# EAGLE design PICTrack (EAGLE 7.2.0)
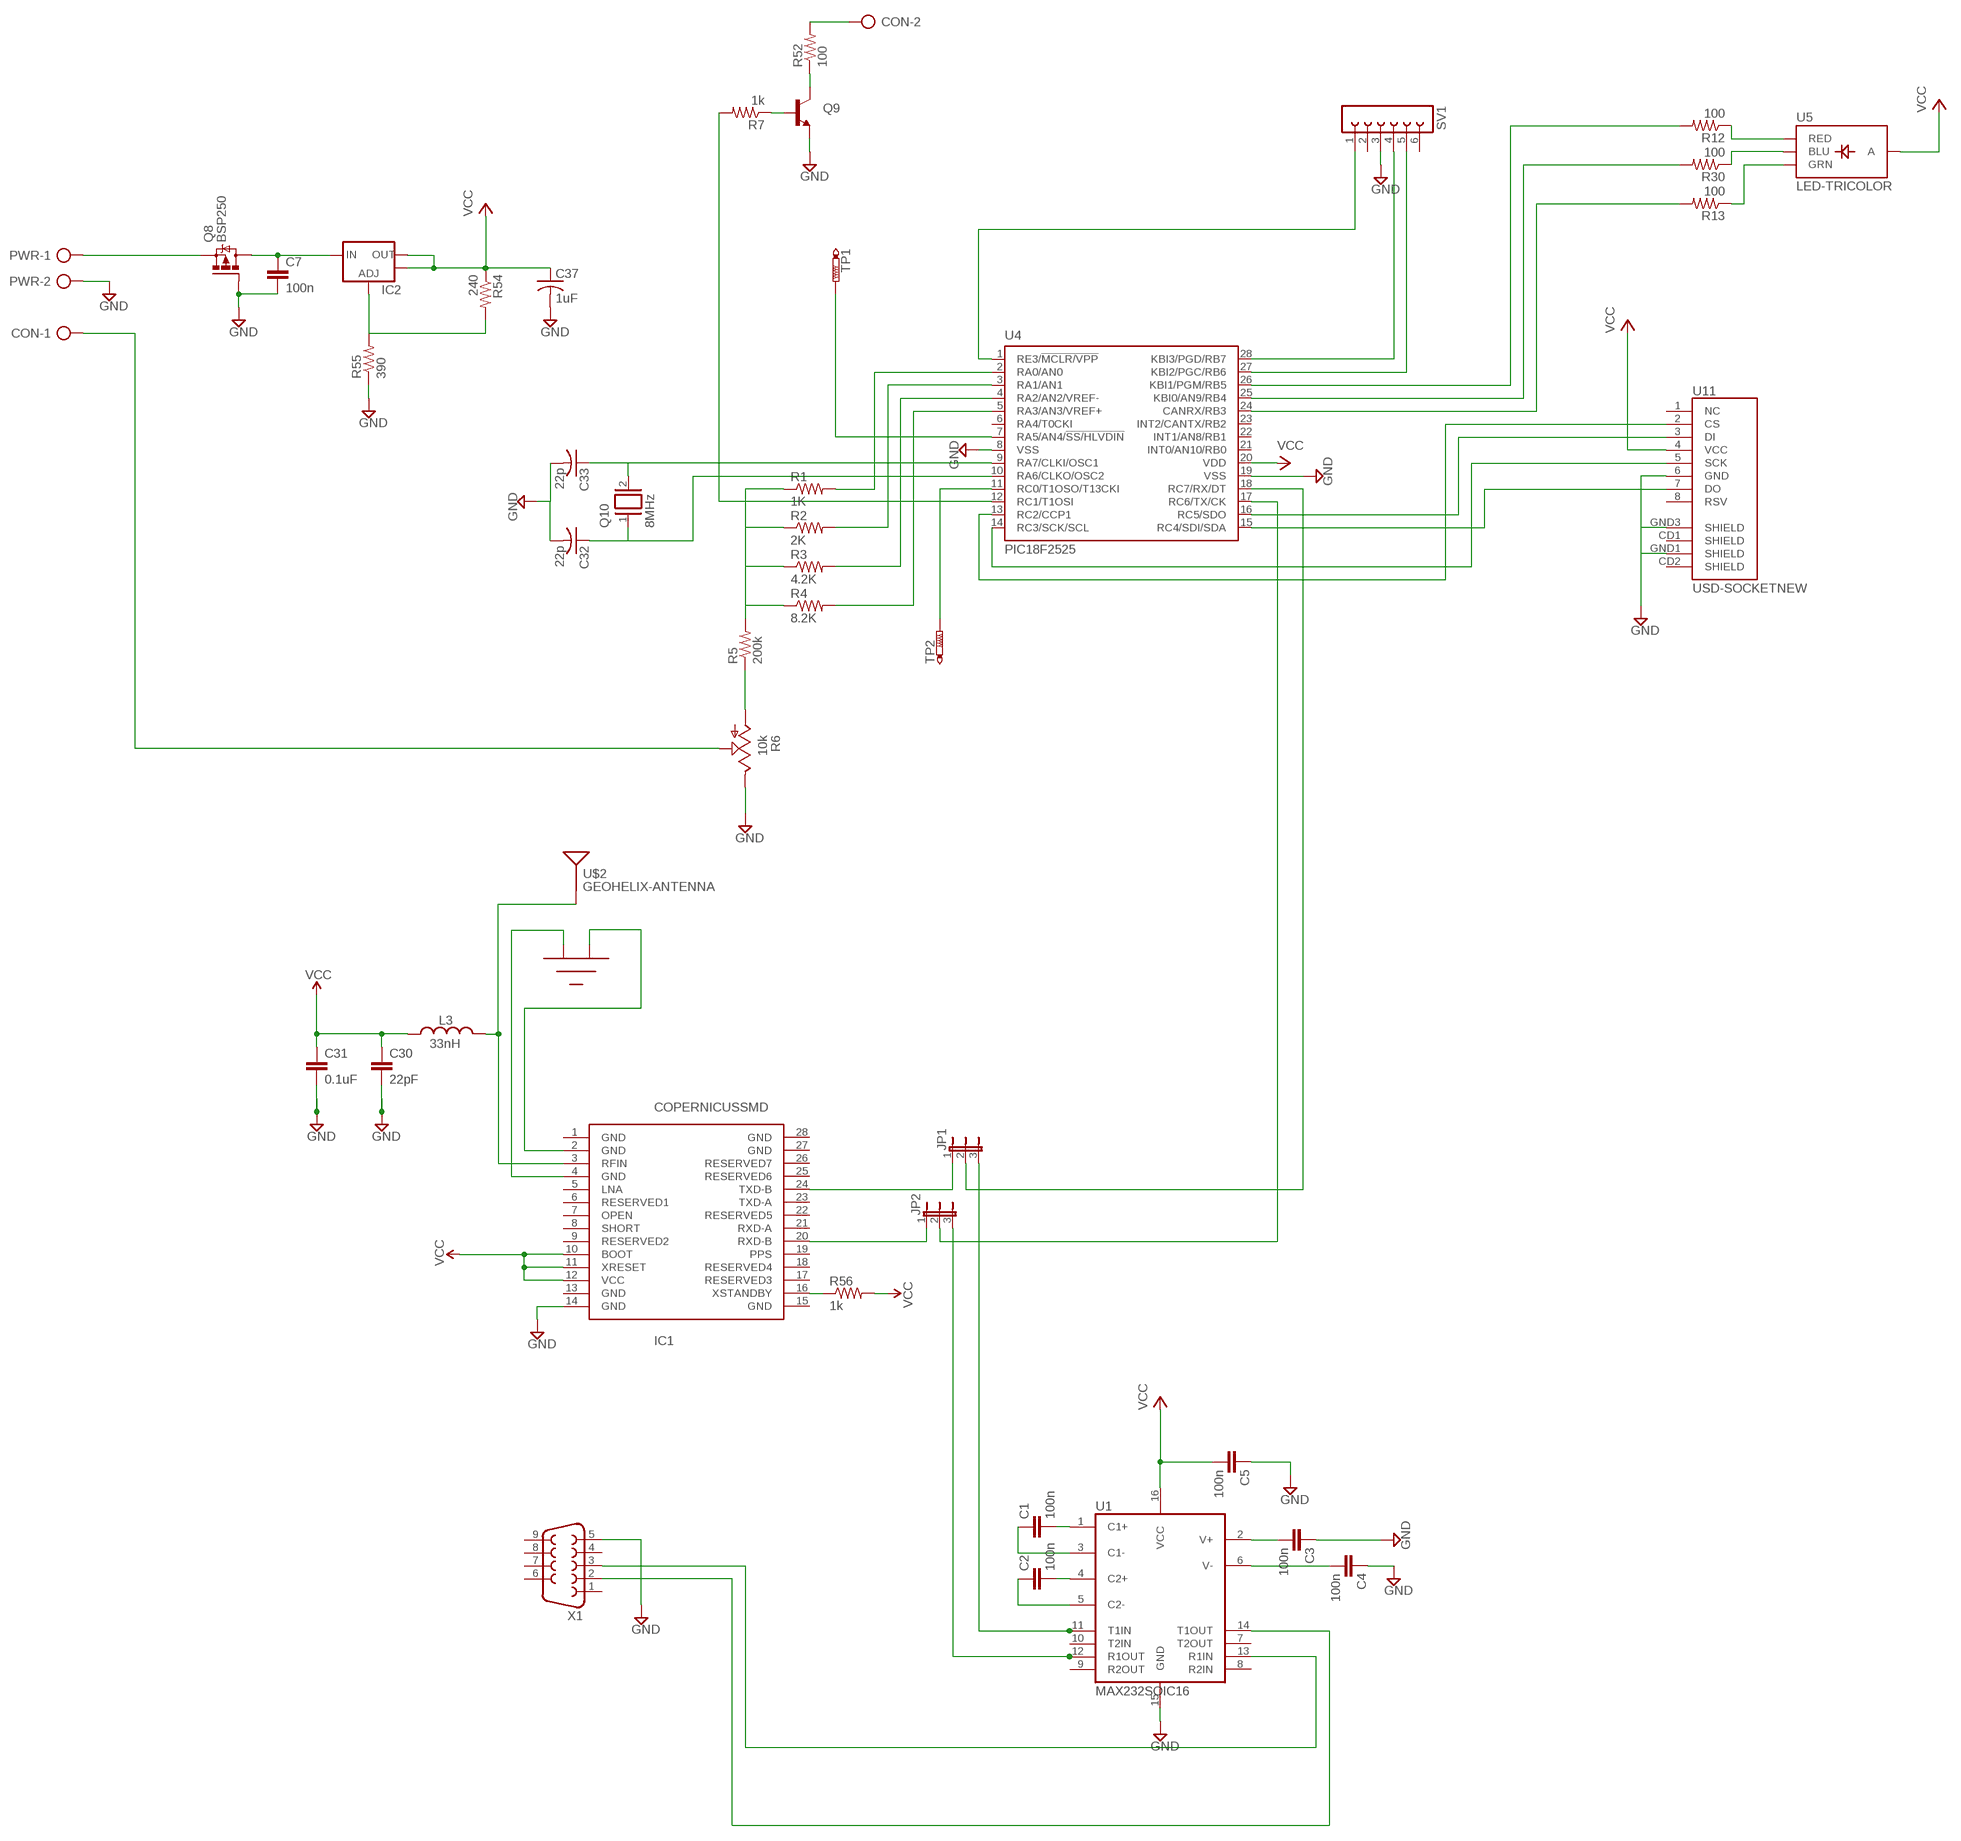
[diagram p0: schematic, sheet 1]

## Parts
C1  100n  C-EUC0402  [C0402]
C2  100n  C-EUC0402  [C0402]
C3  100n  C-EUC0402  [C0402]
C4  100n  C-EUC0402  [C0402]
C5  100n  C-EUC0402  [C0402]
C7  100n  C-EUC0402  [C0402]
C30  22pF  CAP0402-CAP  [0402-CAP]
C31  0.1uF  CAP0402-CAP  [0402-CAP]
C32  22p  C-USC0603  [C0603]
C33  22p  C-USC0603  [C0603]
C37  1uF  C-US025-030X050  [C025-030X050]
CON  AK300/2  [AK300/2]
IC1  COPERNICUSSMD  [COPERNICUS]
IC2  V_REG_LM1117SOT223  [SOT223]
JP1  JP2E  [JP2]
JP2  JP2E  [JP2]
L3  33nH  INDUCTOR0402  [C0402]
PWR  AK300/2  [AK300/2]
Q8  BSP250  [SOT223]
Q9  TRANSISTOR_NPNSOT23  [SOT23]
Q10  8MHz  XTAL/S  [QS]
R1  1K  R-US_0411/3V  [0411V]
R2  2K  R-US_0411/3V  [0411V]
R3  4.2K  R-US_0411/3V  [0411V]
R4  8.2K  R-US_0411/3V  [0411V]
R5  200k  R-US_0411/3V  [0411V]
R6  10k  TRIM_US-CA6V  [CA6V]
R7  1k  R-US_R0603  [R0603]
R12  100  R-US_R0603  [R0603]
R13  100  R-US_R0603  [R0603]
R30  100  R-US_R0603  [R0603]
R52  100  R-US_0411/3V  [0411V]
R54  240  R-US_R0603  [R0603]
R55  390  R-US_R0603  [R0603]
R56  1k  R-US_R0603  [R0603]
SV1  FE06-1  [FE06]
TP1  PTR1PAD1-13  [P1-13]
TP2  PTR1PAD1-13  [P1-13]
U1  MAX232SOIC16  [SO016]
U4  PIC18F2525  PIC18F2525-SOIC  [SO28W]
U5  LED-TRICOLOR  [LED-TRICOLOR-SMD]
U11  USD-SOCKETNEW  [MICRO-SD-SOCKET-PP]
U$2  GEOHELIX-ANTENNA  [HELIXANTENNA]
X1  DB9FEMALE  [DB9]

## Nets
GND: C3.1 C4.1 C5.1 C7.2 C30.2 C31.2 C32.2 C33.2 C37.2 IC1.14(GND) PWR.2 Q8.1(G) Q9.2(E) R6.E R55.1 SV1.3 U1.15(GND) U4.8(VSS) U4.19(VSS) U11.6(GND) U11.GND1(SHIELD) U11.GND3(SHIELD) X1.5
N$1: R5.1 R6.A
N$2: R1.2 U4.2(RA0/AN0)
N$3: R2.2 U4.3(RA1/AN1)
N$4: R3.2 U4.4(RA2/AN2/VREF-)
N$5: R4.2 U4.5(RA3/AN3/VREF+)
N$6: R1.1 R2.1 R3.1 R4.1 R5.2
N$7: PWR.1 Q8.3(S)
N$8: C1.2 U1.1(C1+)
N$9: CON.1 R6.S
N$10: C1.1 U1.3(C1-)
N$11: C2.2 U1.4(C2+)
N$12: C2.1 U1.5(C2-)
N$13: C3.2 U1.2(V+)
N$14: C4.2 U1.6(V-)
N$15: SV1.1 U4.1(RE3/!MCLR/VPP)
N$16: SV1.4 U4.28(KBI3/PGD/RB7)
N$17: IC1.2(GND) U$2.P$3(GND1)
N$18: TP1.TP U4.7(RA5/AN4/!SS/HLVDIN)
N$20: IC1.16(XSTANDBY) R56.1
N$21: R12.1 U5.R(RED)
N$22: R30.1 U5.B(BLU)
N$23: TP2.TP U4.11(RC0/T1OSO/T13CKI)
N$38: JP1.3 U1.11(T1IN)
N$39: IC2.1(ADJ) R54.2 R55.2
N$53: Q9.3(C) R52.1
N$54: CON.2 R52.2
N$55: R7.2 U4.12(RC1/T1OSI)
N$56: Q9.1(B) R7.1
N$57: IC1.4(GND) U$2.P$1(GND)
N$58: U1.13(R1IN) X1.3
N$59: U1.14(T1OUT) X1.2
N$60: SV1.5 U4.27(KBI2/PGC/RB6)
N$61: U4.15(RC4/SDI/SDA) U11.7(DO)
N$62: U4.14(RC3/SCK/SCL) U11.5(SCK)
N$63: U4.16(RC5/SDO) U11.3(DI)
N$64: U4.13(RC2/CCP1) U11.2(CS)
N$65: IC1.24(TXD-B) JP1.1
N$66: C32.1 Q10.1 U4.10(RA6/CLKO/OSC2)
N$67: C33.1 Q10.2 U4.9(RA7/CLKI/OSC1)
N$68: JP2.3 U1.12(R1OUT)
N$69: IC1.20(RXD-B) JP2.1
N$70: C7.1 IC2.3(IN) Q8.2(D)
N$71: R13.1 U5.G(GRN)
N$72: R12.2 U4.26(KBI1/PGM/RB5)
N$73: R30.2 U4.25(KBI0/AN9/RB4)
N$74: R13.2 U4.24(CANRX/RB3)
RFIN: IC1.3(RFIN) L3.2 U$2.P$2(SIGNAL)
RXD: JP2.2 U4.17(RC6/TX/CK)
TXD: JP1.2 U4.18(RC7/RX/DT)
VCC: C5.2 C30.1 C31.1 C37.1 IC1.10(BOOT) IC1.11(XRESET) IC1.12(VCC) IC2.2(OUT) IC2.4(OUT) L3.1 R54.1 R56.2 U1.16(VCC) U4.20(VDD) U5.A U11.4(VCC)
Unconnected: IC1.1(GND) IC1.5(LNA) IC1.6(RESERVED1) IC1.7(OPEN) IC1.8(SHORT) IC1.9(RESERVED2) IC1.13(GND) IC1.15(GND) IC1.17(RESERVED3) IC1.18(RESERVED4) IC1.19(PPS) IC1.21(RXD-A) IC1.22(RESERVED5) IC1.23(TXD-A) IC1.25(RESERVED6) IC1.26(RESERVED7) IC1.27(GND) IC1.28(GND) SV1.2 SV1.6 U1.7(T2OUT) U1.8(R2IN) U1.9(R2OUT) U1.10(T2IN) U4.6(RA4/T0CKI) U4.21(INT0/AN10/RB0) U4.22(INT1/AN8/RB1) U4.23(INT2/CANTX/RB2) U11.1(NC) U11.8(RSV) U11.CD1(SHIELD) U11.CD2(SHIELD) X1.1 X1.4 X1.6 X1.7 X1.8 X1.9

## Library data of the parts
C1-C5 C7 = rcl:C-EU: CAPACITOR, European symbol
C30 C31 = SparkFun:CAP: Capacitor Standard 0603 ceramic capacitor, and 0.1" leaded capacitor.
C32 C33 = rcl:C-US: CAPACITOR, American symbol
C37 = resistor:C-US: CAPACITOR, American symbol
CON PWR = con-ptr500:AK300/2: CONNECTOR
IC1 = SparkFun:COPERNICUS: Copernicus Massively edited and tweaked footprint to meet the Trimble recommended layout and paste layer. Footprint production proven. Spark Fun Electronics SKU : GPS-07951
IC2 = SparkFun:V_REG_LM1117: Voltage Regulator LM1117 Standard adjustable voltage regulator but in SMD form. Spark Fun Electronics SKU : COM-00595
JP1 JP2 = jumper:JP2E: JUMPER
L3 = SparkFun:INDUCTOR: Inductors Basic Inductor/Choke - 0603 and 1206. Footprints are not proven and vary greatly between part numbers.
Q8 = transistor-power:BSP250
Q9 = SparkFun:TRANSISTOR_NPN: Transistor NPN BJT configuration in SOT23 package. MMBT2222 is the common NPN we use. Double check BCE configuration again layout.
Q10 = special:XTAL/S: CRYSTAL
R1-R5 R7 R12 R13 R30 R52 R54-R56 = rcl:R-US_: RESISTOR, American symbol
R6 = pot:TRIM_US-: POTENTIOMETER
SV1 = con-lsta:FE06-1: FEMALE HEADER
TP1 TP2 = testpad:PTR1: TEST PIN
U1 = SparkFun:MAX232: RS232 Transceiver Very common IC. This is generically called 'MAX232', but works with the 3V equivalent MAX3232 generic ICs. Field tested and mother approved. Spark Fun Electronics SKU : COM-00316 (DIP) and COM-00589 (SMD)
U4 = microchip:PIC18F2525-SOIC
U5 = SparkFun:LED-TRICOLOR: Tri-Color LED SMD Proven layout and schematic for triple color LED in SMD package - common anode. Spark Fun Electronics SKU : COM-07844
U11 = SparkFun:USD-SOCKET: microSD Socket Push-push type uSD socket. Schematic element and footprint production proven. Spark Fun Electronics SKU : PRT-00127. tDoc lines correctly indicate media card edge positions when inserting (unlocked, locked, depressed).
U$2 = SparkFun:GEOHELIX-ANTENNA: GeoHelix GPS antenna. Sparkfun SKU GPS-09871
X1 = SparkFun:DB9: DB9 Connector Standard DB9 (D-Sub 9) serial connector. Can be used for CAN bus as well as RS485 and RS232. Footprint production proven. Spark Fun Electronics SKU : PRT-00429

## Net classes
0 default: width 0.254 mm

## Board
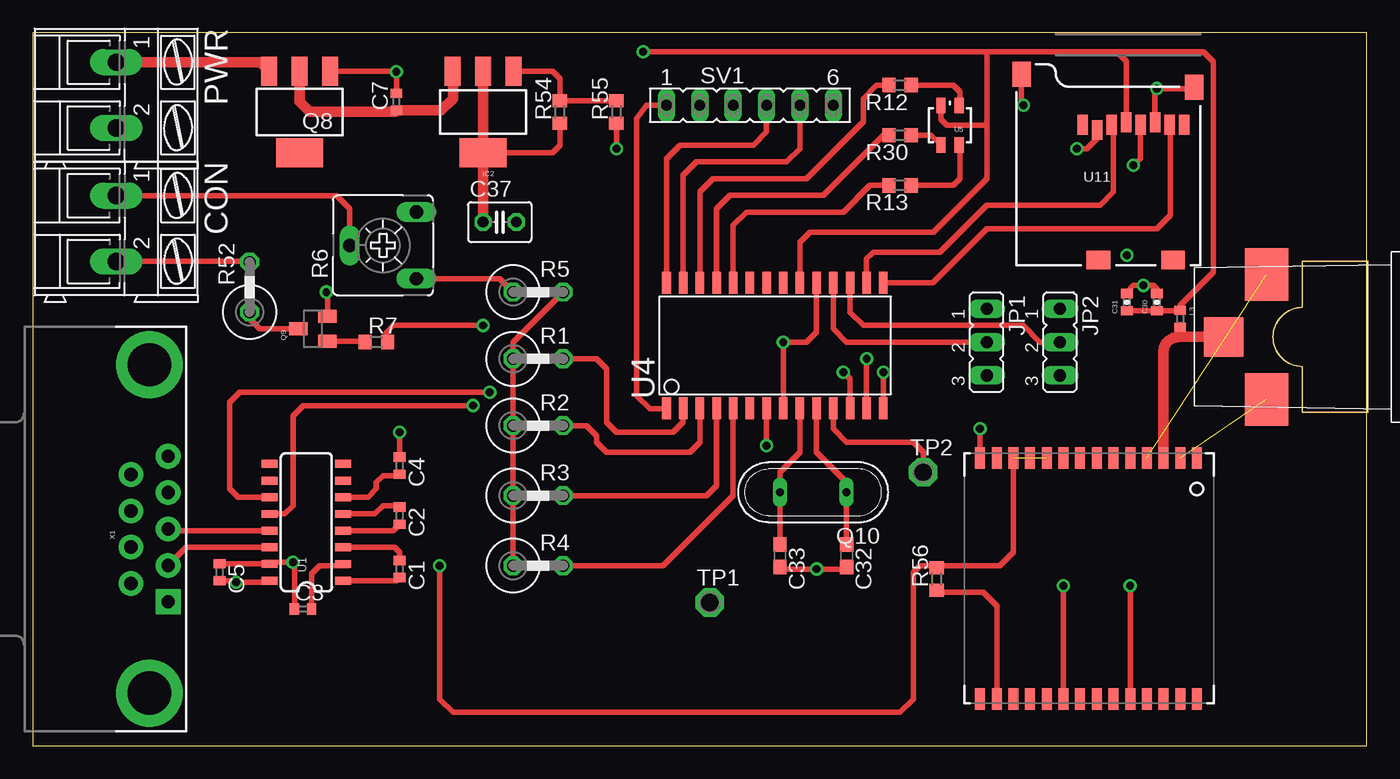
[diagram p1: board, top side]
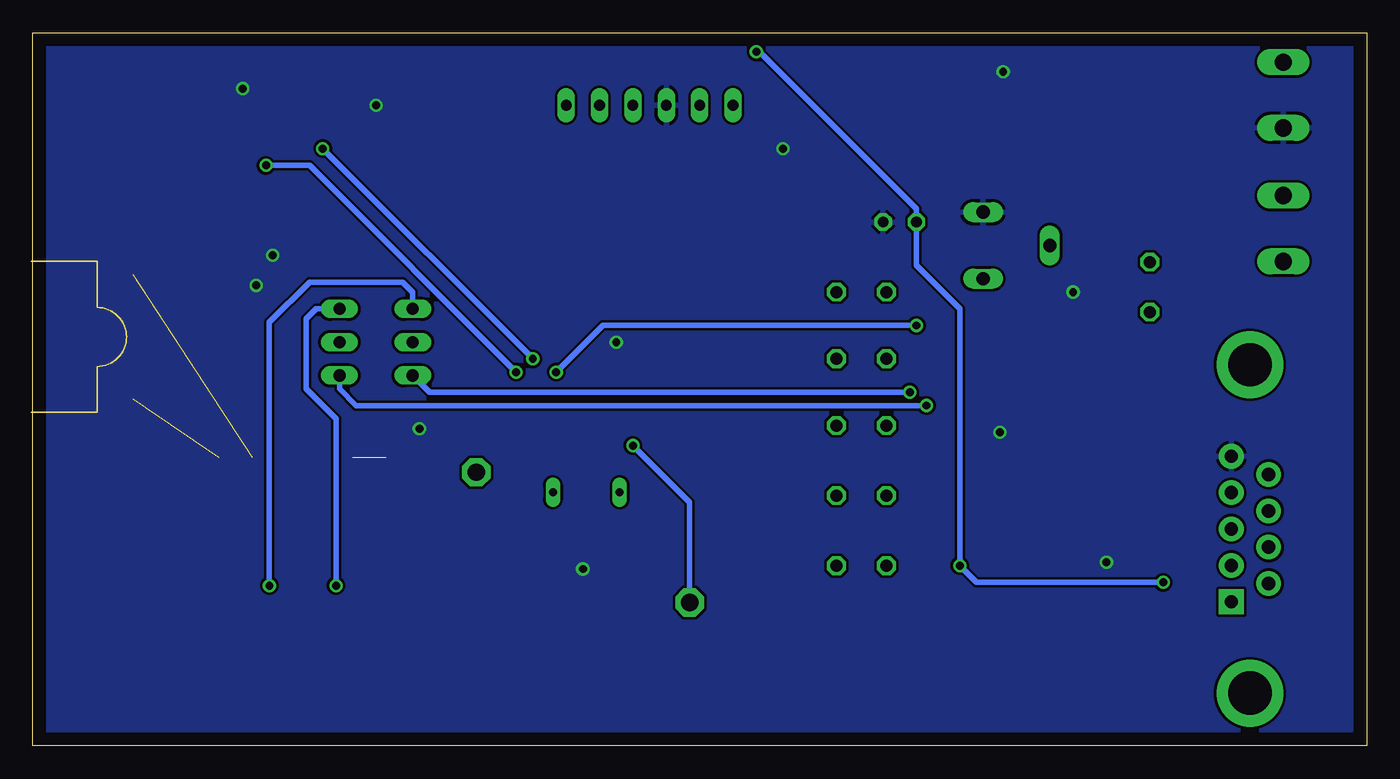
[diagram p2: board, bottom side, seen from below]

Size 101.58 x 54.28 mm. Coordinates in mm from the lower left corner, seen from the top.
Outline: 0,0 101.58,0 101.58,54.28 0,54.28 0,0
Copper layers (1*16): Top 0.035mm / dielectric 1.5mm / Bottom 0.035mm
Design rules "default": minimum track width 10mil, minimum drill 24mil, track to track 8mil, track to pad 8mil, pad to pad 8mil, via to via 8mil, smd to smd 8mil, copper to edge 40mil, drill to drill 8mil, minimum pad ring 10mil, minimum via ring 8mil, stop-mask expansion 4mil, vias tented up to drill 0mil, thermal gap 10mil

### Footprints (pad centres in the part's own frame; a part is rotated, then mirrored left to right if it is on the bottom)
C0402 = smd 0.7 x 0.9: 1 -0.65,0; 2 0.65,0
0402-CAP = smd 0.7 x 0.9: 1 -0.65,0; 2 0.65,0
C0603 = smd 1.1 x 1: 1 -0.85,0; 2 0.85,0
C025-030X050 = drill 0.813 octagon: 1 -1.27,0; 2 1.27,0
AK300/2 = drill 1.321 long: 1 -2.515,0; 2 2.489,0
COPERNICUS = smd 0.762 x 1.651: 1 0,-18.364; 2 1.27,-18.364; 3 2.54,-18.364; 4 3.81,-18.364; 5 5.08,-18.364; 6 6.35,-18.364; 7 7.62,-18.364; 8 8.89,-18.364; 9 10.16,-18.364; 10 11.43,-18.364; 11 12.7,-18.364; 12 13.97,-18.364; 13 15.24,-18.364; 14 16.51,-18.364; 15 16.51,0; 16 15.24,0; 17 13.97,0; 18 12.7,0; 19 11.43,0; 20 10.16,0; 21 8.89,0; 22 7.62,0; 23 6.35,0; 24 5.08,0; 25 3.81,0; 26 2.54,0; 27 1.27,0; 28 0,0
SOT223 = smd 1.219 x 2.235: 1 -2.311,-3.099; 2 0,-3.099; 3 2.311,-3.099 | smd 3.6 x 2.2: 4 0,3.099
JP2 = drill 0.914 long: 1 -2.54,0; 2 0,0; 3 2.54,0
SOT23 = smd 1 x 1.4: 1 -0.95,-1.1; 2 0.95,-1.1; 3 0,1.1
QS = drill 0.61 long: 1 -2.54,0; 2 2.54,0
0411V = drill 0.914 octagon: 1 -2.54,0; 2 1.27,0
CA6V = drill 1.016 long: A -2.54,-2.54; E 2.54,-2.54; S 0,2.54
R0603 = smd 1 x 1.1: 1 -0.85,0; 2 0.85,0
FE06 = drill 0.813 long: 1 -6.35,0; 2 -3.81,0; 3 -1.27,0; 4 1.27,0; 5 3.81,0; 6 6.35,0
P1-13 = drill 1.321 pad 2.159 octagon: TP 0,0
SO016 = smd 0.6 x 1.2: 1 -4.445,-2.8; 2 -3.175,-2.8; 3 -1.905,-2.8; 4 -0.635,-2.8; 5 0.635,-2.8; 6 1.905,-2.8; 7 3.175,-2.8; 8 4.445,-2.8; 9 4.445,2.8; 10 3.175,2.8; 11 1.905,2.8; 12 0.635,2.8; 13 -0.635,2.8; 14 -1.905,2.8; 15 -3.175,2.8; 16 -4.445,2.8
SO28W = smd 0.65 x 1.7: 1 -7.62,-4.78; 2 -6.35,-4.78; 3 -5.08,-4.78; 4 -3.81,-4.78; 5 -2.54,-4.78; 6 -1.27,-4.78; 7 0,-4.78; 8 1.27,-4.78; 9 2.54,-4.78; 10 3.81,-4.78; 11 5.08,-4.78; 12 6.35,-4.78; 13 7.62,-4.78; 14 8.89,-4.78; 15 8.89,4.78; 16 7.62,4.78; 17 6.35,4.78; 18 5.08,4.78; 19 3.81,4.78; 20 2.54,4.78; 21 1.27,4.78; 22 0,4.78; 23 -1.27,4.78; 24 -2.54,4.78; 25 -3.81,4.78; 26 -5.08,4.78; 27 -6.35,4.78; 28 -7.62,4.78
LED-TRICOLOR-SMD = smd 0.7 x 1.2: A 0.7,-1.5; B 0.7,1.5; G -0.7,1.5; R -0.7,-1.5
MICRO-SD-SOCKET-PP = smd 0.8 x 1.5: 1 -8.94,10.7; 2 -7.84,10.3; 3 -6.74,10.7; 4 -5.64,10.9; 5 -4.54,10.7; 6 -3.44,10.9; 7 -2.34,10.7; 8 -1.24,10.7 | smd 1.8 x 1.4: CD1 -2.05,0.4; CD2 -7.75,0.4 | smd 1.4 x 1.9: GND1 -13.6,14.55; GND3 -0.45,13.55
HELIXANTENNA = smd 4 x 3.3: P$1 4,2.25; P$3 13.5,2.25 | smd 3 x 3: P$2 8.75,-1
DB9 = drill 1.016 pad 1.88 square: 1 -5.54,-1.42 | drill 1.016 pad 1.88: 2 -2.77,-1.42; 3 0,-1.42; 4 2.77,-1.42; 5 5.54,-1.42; 6 -4.15,1.42; 7 -1.38,1.42; 8 1.38,1.42; 9 4.15,1.42 | drill 3.302 pad 5.08: G1 -12.5,0; G2 12.5,0

### Placement (x,y rotation side)
C1  27.94,13.46 270 top
C2  27.94,17.53 270 top
C3  20.57,10.41 0 top
C4  27.94,21.34 270 top
C5  14.22,13.21 270 top
C7  27.69,49.02 90 top
C30  85.6,33.78 90 top
C31  83.31,33.78 90 top
C32  61.98,14.48 270 top
C33  56.9,14.48 270 top
C37  35.56,39.88 0 top
CON  6.35,39.37 270 top
IC1  88.65,3.56 180 top
IC2  34.29,48.26 180 top
JP1  72.64,30.73 270 top
JP2  78.23,30.73 270 top
L3  87.38,32.51 270 top
PWR  6.35,49.53 270 top
Q8  20.32,48.26 180 top
Q9  21.34,31.75 90 top
Q10  59.44,19.3 180 top
R1  39.12,29.46 0 top
R2  39.12,24.38 0 top
R3  39.12,19.05 0 top
R4  39.12,13.72 0 top
R5  39.12,34.54 0 top
R6  26.67,38.1 90 top
R7  26.16,30.73 0 top
R12  66.04,50.29 180 top
R13  66.04,42.67 180 top
R30  66.04,46.48 180 top
R52  16.51,35.56 90 top
R54  40.13,48.26 90 top
R55  44.45,48.26 90 top
R56  68.83,12.7 90 top
SV1  54.61,48.77 0 top
TP1  51.56,10.92 0 top
TP2  67.82,20.83 0 top
U1  20.83,17.02 90 top
U4  55.88,30.48 0 top
U5  69.85,47.24 180 top
U11  88.9,36.58 0 top
U$2  91.69,39.88 270 top
X1  8.89,16.51 90 top

### Tracks (layer width: path | path; a pad name or v marks a point on that pad's centre or on a via)
GND  (via drill 0.6)
  Top 0.406: Q8.1 27.64,51.36 v27.69,51.31 C7.2 | v44.45,45.47 R55.1 | C33.2 57.06,13.46 v59.69,13.46 62.06,13.46 C32.2 | Q9.2 22.44,34.46 v22.35,34.54 | U11.6 85.46,49.9 v85.6,50.04 88.36,50.04 U11.GND3 | U11.GND1 75.3,48.91 v75.44,48.77 | U4.8 v57.15,30.73 58.93,30.73 59.69,31.5 U4.19 | C5.1 17.5,13.86 U1.15 17.64,13.97 v19.81,13.97 19.92,13.86 C3.1 | C4.1 v27.94,23.88 | IC1.14 v72.14,24.13 | C31.2 83.31,34.54 83.82,35.05 v84.58,35.05 85.34,35.05 85.6,34.8 C30.2
  other vias: 83.31,37.34
  pour Bottom: 0,0 101.6,0 101.6,54.61 0,54.61
N$1
  Top 0.406: R6.A 35.56,35.56 R5.1
N$2
  Top 0.406: R1.2 42.93,29.46 43.69,28.7 43.69,24.64 44.45,23.88 48.77,23.88 49.53,24.64 U4.2
N$3
  Top 0.406: R2.2 42.16,24.38 42.93,23.62 42.93,23.11 43.69,22.35 50.04,22.35 50.8,23.11 U4.3
N$4
  Top 0.406: R3.2 51.31,19.05 52.07,19.81 U4.4
N$5
  Top 0.406: R4.2 48.01,13.72 53.34,19.05 U4.5
N$6
  Top 0.406: R5.2 36.58,30.73 R1.1 R2.1 R3.1 R4.1
N$7
  Top 0.813: PWR.1 17.32,52.05 Q8.3
N$8
  Top 0.406: U1.1 27.7,12.57 C1.2
N$9
  Top 0.406: CON.1 23.14,41.89 24.13,40.89 R6.S
N$10
  Top 0.406: U1.3 27.56,15.11 27.94,14.73 C1.1
N$11
  Top 0.406: U1.4 27.45,16.38 C2.2
N$12
  Top 0.406: U1.5 26.04,17.65 26.67,18.29 27.83,18.29 C2.1
N$13
  Top 0.406: C3.2 21.22,13.1 21.84,13.72 24.02,13.72 U1.2
N$14
  Top 0.406: U1.6 25.53,18.92 26.16,19.56 26.16,20.07 26.67,20.57 27.83,20.57 C4.2
N$15
  Top 0.406: SV1.1 46.74,48.77 45.97,47.75 45.97,26.67 46.99,25.65 48.21,25.65 U4.1
N$16
  Top 0.406: U4.28 48.26,44.7 49.28,45.72 54.86,45.72 55.88,46.74 SV1.4
N$17  (1 unrouted)
N$18  (via drill 0.6)
  Top 0.406: v55.88,22.86 U4.7
  Bottom 0.406: v55.88,22.86 51.56,18.54 TP1.TP
N$20
  Top 0.406: IC1.16 73.41,10.67 72.39,11.68 69,11.68 R56.1
N$21
  Top 0.406: R12.1 70.1,50.29 70.61,49.78 70.61,48.81 U5.R
N$22
  Top 0.406: R30.1 68.41,46.48 U5.B
N$23
  Top 0.406: U4.11 60.96,24.13 61.98,23.11 67.06,23.11 67.82,22.35 TP2.TP
N$38  (via drill 0.6)
  Top 0.406: U1.11 15.62,18.92 14.99,19.56 14.99,26.16 15.75,26.92 v34.8,26.92
  Bottom 0.406: v34.8,26.92 71.37,26.92 JP1.3
N$39
  Top 0.406: IC2.1 39.57,51.36 40.13,50.8 R54.2 R55.2
N$53
  Top 0.406: R52.1 16.51,32.51 17.27,31.75 Q9.3
N$54
  Top 0.406: CON.2 16.46,36.88 R52.2
N$55  (via drill 0.6)
  Top 0.406: U4.12 62.23,27.94 v61.72,28.45 | v34.29,32 27.43,32 26.92,31.5 26.92,30.82 R7.2
  Bottom 0.406: v61.72,28.45 58.17,32 v34.29,32
N$56
  Top 0.406: Q9.1 25.25,30.8 R7.1
N$57  (1 unrouted)
N$58
  Top 0.406: U1.13 10.44,16.38 X1.3
N$59
  Top 0.406: U1.14 11.68,15.11 X1.2
N$60
  Top 0.406: U4.27 49.53,43.43 50.55,44.45 57.4,44.45 58.42,45.47 SV1.5
N$61
  Top 0.406: U4.15 68.53,35.26 72.64,39.37 85.6,39.37 86.61,40.39 86.61,47.22 U11.7
N$62  (via drill 0.6)
  Top 0.406: U4.14 v64.77,28.45 | v83.82,44.2 84.33,44.7 84.33,47.24 U11.5
  Bottom 0.406: v64.77,28.45 80.52,44.2 v83.82,44.2
N$63
  Top 0.406: U4.16 63.5,37.08 64.01,37.59 69.09,37.59 72.64,41.15 81.28,41.15 82.3,42.16 82.3,47.14 U11.3
N$64  (via drill 0.6)
  Top 0.406: U4.13 v63.5,29.46 | v79.5,45.47 80.26,45.47 81.03,46.23 81.03,46.84 U11.2
  Bottom 0.406: v63.5,29.46 v79.5,45.47
N$65  (via drill 0.6)
  Top 0.406: IC1.24 v83.57,12.19
  Bottom 0.406: v83.57,12.19 83.57,32.26 80.52,35.31 73.41,35.31 72.64,34.54 JP1.1
N$66
  Top 0.406: C32.1 Q10.1 61.98,20.07 59.69,22.35 U4.10
N$67
  Top 0.406: C33.1 Q10.2 56.9,20.83 58.42,22.35 U4.9
N$68  (via drill 0.6)
  Top 0.406: U1.12 19.18,17.65 19.81,18.29 19.81,25.15 20.57,25.91 v33.53,25.91
  Bottom 0.406: v33.53,25.91 76.96,25.91 78.23,27.18 JP2.3
N$69  (via drill 0.6)
  Top 0.406: IC1.20 v78.49,12.19
  Bottom 0.406: v78.49,12.19 78.49,24.89 80.77,27.18 80.77,32.51 80.01,33.27 JP2.1
N$70
  Top 0.813: Q8.2 20.32,49.02 21.08,48.26 27.57,48.26 C7.1 31.1,48.37 32,49.28 32,51.33 IC2.3
N$71
  Top 0.406: R13.1 70.1,42.67 70.61,43.18 70.61,45.68 U5.G
N$72
  Top 0.406: U4.26 50.8,42.16 51.82,43.18 58.93,43.18 63.25,47.5 63.25,49.28 64.26,50.29 R12.2
N$73
  Top 0.406: U4.25 52.07,40.89 53.09,41.91 60.2,41.91 64.77,46.48 R30.2
N$74
  Top 0.406: U4.24 53.34,39.62 54.36,40.64 61.72,40.64 63.75,42.67 R13.2
RFIN
  Top 0.813: 87.26,31.13 U$2.P$2 | 87.26,31.13 arc90 86.11,29.97 IC1.3 | L3.2 87.38,31.24 arc-90 87.26,31.13
RXD
  Top 0.406: U4.17 62.23,33.02 63.25,32 75.44,32 76.71,30.73 JP2.2
TXD
  Top 0.406: U4.18 60.96,31.75 61.98,30.73 JP1.2
VCC  (via drill 0.6)  (2 unrouted)
  Top 0.406: IC2.4 39.57,45.16 40.13,45.72 R54.1 | U11.4 83.26,52.12 82.55,52.83 | v46.48,52.83 72.64,52.83 | 72.64,52.83 82.55,52.83 | U4.20 58.42,38.35 59.18,39.12 68.58,39.12 72.64,43.18 72.64,47.24 | 72.64,52.83 72.64,47.24 | U5.A 69.15,47.69 69.6,47.24 72.64,47.24 | U1.16 17.39,12.45 v15.49,12.45 15.38,12.56 C5.2 | IC1.12 74.68,14.73 73.66,13.72 68.67,13.72 | v30.99,13.72 30.99,3.56 32,2.54 66.04,2.54 67.06,3.56 67.06,13.21 67.56,13.72 68.67,13.72 | 68.67,13.72 R56.2 | 82.55,52.83 89.15,52.83 89.92,52.07 89.92,36.07 87.38,33.53 L3.1 87.35,33.13 C30.1 C31.1
  Top 0.813: IC2.2 IC2.4 C37.1
  Bottom 0.406: v46.48,52.83 46.23,52.83 34.29,40.89 C37.1 34.29,36.58 30.99,33.27 v30.99,13.72 29.72,12.45 v15.49,12.45